# EAGLE board experimenter (EAGLE 9.6.2), part 1 of 3
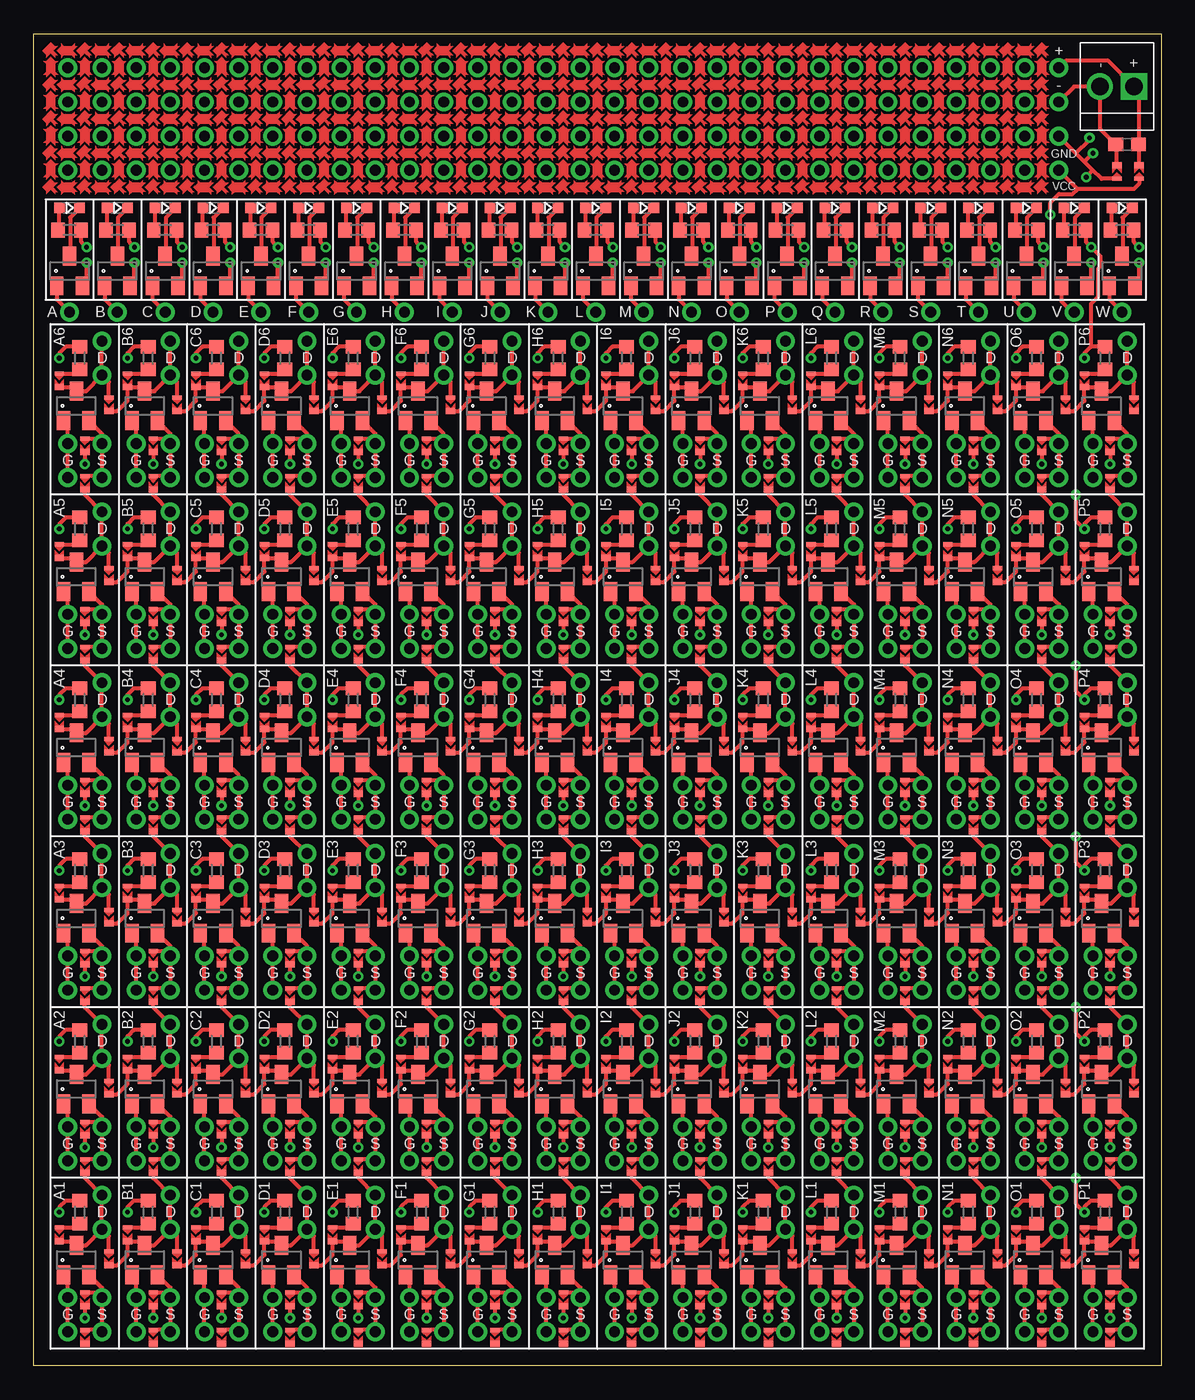
[diagram p3: board, top side]
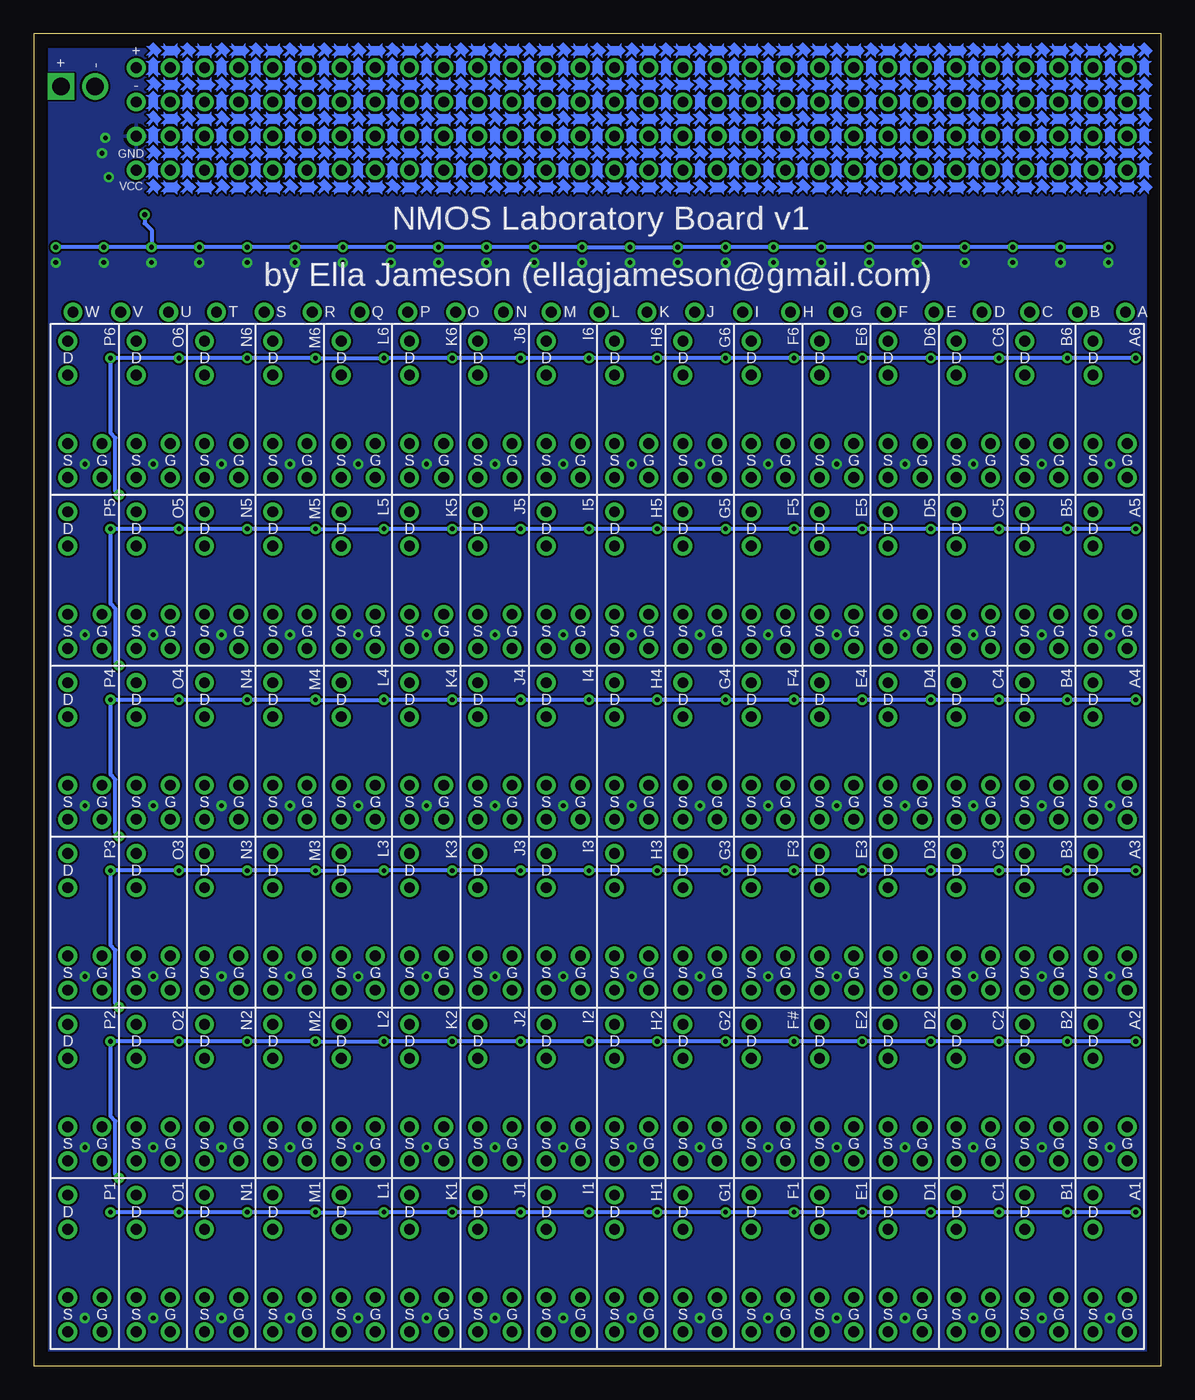
[diagram p4: board, bottom side, seen from below]

Size 83.82 x 99.06 mm. Coordinates in mm from the lower left corner, seen from the top.
Outline: 0,0 0,99.06 83.82,99.06 83.82,0 0,0
Copper layers (1*16): Top 0.035mm / dielectric 1.5mm / Bottom 0.035mm
Design rules "default": minimum track width 6mil, minimum drill 0.35mm, track to track 6mil, track to pad 6mil, pad to pad 6mil, via to via 6mil, smd to smd 6mil, copper to edge 40mil, drill to drill 6mil, minimum pad ring 10mil, minimum via ring 8mil, stop-mask expansion 4mil, vias tented up to drill 0mil, thermal gap 10mil

## Footprints (pad centres in the part's own frame; a part is rotated, then mirrored left to right if it is on the bottom)
C0603 = smd 1.1 x 1: 1 -0.85,0; 2 0.85,0
CHIP-LED0603 = smd 0.8 x 0.8: A 0,-0.75; C 0,0.75
PROTOPAD-THT-PAD = drill 0.8 pad 1.4: P1 0,0
OSTVN02A150 = drill 1.3 square: P$1 -1.27,0 | drill 1.3: P$2 1.27,0
SJ_2S-NO-THIN = smd 0.45 x 0.7: 1 -0.508,0 | smd 0.3 x 0.7: 2 0.508,0
SOT23 = smd 1 x 1.4: 1 -0.95,-1.1; 2 0.95,-1.1; 3 0,1.1
R0603 = smd 1 x 1.1: 1 -0.85,0; 2 0.85,0
PROTOPAD-THT = drill 0.8 pad 1.4: P1 0,0

## Placement (x,y rotation side)
C4  0.1u  [C0603]  81.28,90.81 0 top
D2  [CHIP-LED0603]  2.67,86.11 270 top
D3  [CHIP-LED0603]  16.89,86.11 270 top
D4  [CHIP-LED0603]  6.22,86.11 270 top
D5  [CHIP-LED0603]  24,86.11 270 top
D6  [CHIP-LED0603]  9.78,86.11 270 top
D7  [CHIP-LED0603]  20.45,86.11 270 top
D8  [CHIP-LED0603]  13.34,86.11 270 top
D9  [CHIP-LED0603]  27.56,86.11 270 top
D10  [CHIP-LED0603]  31.11,86.11 270 top
D11  [CHIP-LED0603]  34.67,86.11 270 top
D12  [CHIP-LED0603]  38.23,86.11 270 top
D13  [CHIP-LED0603]  41.78,86.11 270 top
D14  [CHIP-LED0603]  45.34,86.11 270 top
D15  [CHIP-LED0603]  48.9,86.11 270 top
D16  [CHIP-LED0603]  52.45,86.11 270 top
D17  [CHIP-LED0603]  56.01,86.11 270 top
D18  [CHIP-LED0603]  59.56,86.11 270 top
D19  [CHIP-LED0603]  63.12,86.11 270 top
D20  [CHIP-LED0603]  66.67,86.11 270 top
D21  [CHIP-LED0603]  70.23,86.11 270 top
D22  [CHIP-LED0603]  73.79,86.11 270 top
D23  [CHIP-LED0603]  77.34,86.11 270 top
D24  [CHIP-LED0603]  80.9,86.11 270 top
DRAINA2  TPTHT  [PROTOPAD-THT-PAD]  5.08,25.4 0 top
DRAINA3  TPTHT  [PROTOPAD-THT-PAD]  10.16,25.4 0 top
DRAINA4  TPTHT  [PROTOPAD-THT-PAD]  15.24,25.4 0 top
DRAINA5  TPTHT  [PROTOPAD-THT-PAD]  20.32,25.4 0 top
DRAINA21  TPTHT  [PROTOPAD-THT-PAD]  25.4,25.4 0 top
DRAINA22  TPTHT  [PROTOPAD-THT-PAD]  30.48,25.4 0 top
DRAINA23  TPTHT  [PROTOPAD-THT-PAD]  35.56,25.4 0 top
DRAINA24  TPTHT  [PROTOPAD-THT-PAD]  40.64,25.4 0 top
DRAINA25  TPTHT  [PROTOPAD-THT-PAD]  45.72,25.4 0 top
DRAINA26  TPTHT  [PROTOPAD-THT-PAD]  50.8,25.4 0 top
DRAINA27  TPTHT  [PROTOPAD-THT-PAD]  55.88,25.4 0 top
DRAINA28  TPTHT  [PROTOPAD-THT-PAD]  60.96,25.4 0 top
DRAINA29  TPTHT  [PROTOPAD-THT-PAD]  66.04,25.4 0 top
DRAINA30  TPTHT  [PROTOPAD-THT-PAD]  71.12,25.4 0 top
DRAINA31  TPTHT  [PROTOPAD-THT-PAD]  76.2,25.4 0 top
DRAINA32  TPTHT  [PROTOPAD-THT-PAD]  81.28,25.4 0 top
DRAINA33  TPTHT  [PROTOPAD-THT-PAD]  5.08,12.7 0 top
DRAINA34  TPTHT  [PROTOPAD-THT-PAD]  10.16,12.7 0 top
DRAINA35  TPTHT  [PROTOPAD-THT-PAD]  15.24,12.7 0 top
DRAINA36  TPTHT  [PROTOPAD-THT-PAD]  20.32,12.7 0 top
DRAINA37  TPTHT  [PROTOPAD-THT-PAD]  25.4,12.7 0 top
DRAINA38  TPTHT  [PROTOPAD-THT-PAD]  30.48,12.7 0 top
DRAINA39  TPTHT  [PROTOPAD-THT-PAD]  35.56,12.7 0 top
DRAINA40  TPTHT  [PROTOPAD-THT-PAD]  40.64,12.7 0 top
DRAINA41  TPTHT  [PROTOPAD-THT-PAD]  45.72,12.7 0 top
DRAINA42  TPTHT  [PROTOPAD-THT-PAD]  50.8,12.7 0 top
DRAINA43  TPTHT  [PROTOPAD-THT-PAD]  55.88,12.7 0 top
DRAINA44  TPTHT  [PROTOPAD-THT-PAD]  60.96,12.7 0 top
DRAINA45  TPTHT  [PROTOPAD-THT-PAD]  66.04,12.7 0 top
DRAINA46  TPTHT  [PROTOPAD-THT-PAD]  71.12,12.7 0 top
DRAINA47  TPTHT  [PROTOPAD-THT-PAD]  76.2,12.7 0 top
DRAINA48  TPTHT  [PROTOPAD-THT-PAD]  81.28,12.7 0 top
DRAINA49  TPTHT  [PROTOPAD-THT-PAD]  5.08,38.1 0 top
DRAINA50  TPTHT  [PROTOPAD-THT-PAD]  10.16,38.1 0 top
DRAINA51  TPTHT  [PROTOPAD-THT-PAD]  15.24,38.1 0 top
DRAINA52  TPTHT  [PROTOPAD-THT-PAD]  20.32,38.1 0 top
DRAINA53  TPTHT  [PROTOPAD-THT-PAD]  25.4,38.1 0 top
DRAINA54  TPTHT  [PROTOPAD-THT-PAD]  30.48,38.1 0 top
DRAINA55  TPTHT  [PROTOPAD-THT-PAD]  35.56,38.1 0 top
DRAINA56  TPTHT  [PROTOPAD-THT-PAD]  40.64,38.1 0 top
DRAINA57  TPTHT  [PROTOPAD-THT-PAD]  45.72,38.1 0 top
DRAINA58  TPTHT  [PROTOPAD-THT-PAD]  50.8,38.1 0 top
DRAINA59  TPTHT  [PROTOPAD-THT-PAD]  55.88,38.1 0 top
DRAINA60  TPTHT  [PROTOPAD-THT-PAD]  60.96,38.1 0 top
DRAINA61  TPTHT  [PROTOPAD-THT-PAD]  66.04,38.1 0 top
DRAINA62  TPTHT  [PROTOPAD-THT-PAD]  71.12,38.1 0 top
DRAINA63  TPTHT  [PROTOPAD-THT-PAD]  76.2,38.1 0 top
DRAINA64  TPTHT  [PROTOPAD-THT-PAD]  81.28,38.1 0 top
DRAINA65  TPTHT  [PROTOPAD-THT-PAD]  5.08,50.8 0 top
DRAINA66  TPTHT  [PROTOPAD-THT-PAD]  10.16,50.8 0 top
DRAINA67  TPTHT  [PROTOPAD-THT-PAD]  15.24,50.8 0 top
DRAINA68  TPTHT  [PROTOPAD-THT-PAD]  20.32,50.8 0 top
DRAINA69  TPTHT  [PROTOPAD-THT-PAD]  25.4,50.8 0 top
DRAINA70  TPTHT  [PROTOPAD-THT-PAD]  30.48,50.8 0 top
DRAINA71  TPTHT  [PROTOPAD-THT-PAD]  35.56,50.8 0 top
DRAINA72  TPTHT  [PROTOPAD-THT-PAD]  40.64,50.8 0 top
DRAINA73  TPTHT  [PROTOPAD-THT-PAD]  45.72,50.8 0 top
DRAINA74  TPTHT  [PROTOPAD-THT-PAD]  50.8,50.8 0 top
DRAINA75  TPTHT  [PROTOPAD-THT-PAD]  55.88,50.8 0 top
DRAINA76  TPTHT  [PROTOPAD-THT-PAD]  60.96,50.8 0 top
DRAINA77  TPTHT  [PROTOPAD-THT-PAD]  66.04,50.8 0 top
DRAINA78  TPTHT  [PROTOPAD-THT-PAD]  71.12,50.8 0 top
DRAINA79  TPTHT  [PROTOPAD-THT-PAD]  76.2,50.8 0 top
DRAINA80  TPTHT  [PROTOPAD-THT-PAD]  81.28,50.8 0 top
DRAINA81  TPTHT  [PROTOPAD-THT-PAD]  5.08,63.5 0 top
DRAINA82  TPTHT  [PROTOPAD-THT-PAD]  10.16,63.5 0 top
DRAINA83  TPTHT  [PROTOPAD-THT-PAD]  15.24,63.5 0 top
DRAINA84  TPTHT  [PROTOPAD-THT-PAD]  20.32,63.5 0 top
DRAINA85  TPTHT  [PROTOPAD-THT-PAD]  25.4,63.5 0 top
DRAINA86  TPTHT  [PROTOPAD-THT-PAD]  30.48,63.5 0 top
DRAINA87  TPTHT  [PROTOPAD-THT-PAD]  35.56,63.5 0 top
DRAINA88  TPTHT  [PROTOPAD-THT-PAD]  40.64,63.5 0 top
DRAINA89  TPTHT  [PROTOPAD-THT-PAD]  45.72,63.5 0 top
DRAINA90  TPTHT  [PROTOPAD-THT-PAD]  50.8,63.5 0 top
DRAINA91  TPTHT  [PROTOPAD-THT-PAD]  55.88,63.5 0 top
DRAINA92  TPTHT  [PROTOPAD-THT-PAD]  60.96,63.5 0 top
DRAINA93  TPTHT  [PROTOPAD-THT-PAD]  66.04,63.5 0 top
DRAINA94  TPTHT  [PROTOPAD-THT-PAD]  71.12,63.5 0 top
DRAINA95  TPTHT  [PROTOPAD-THT-PAD]  76.2,63.5 0 top
DRAINA96  TPTHT  [PROTOPAD-THT-PAD]  81.28,63.5 0 top
DRAINA97  TPTHT  [PROTOPAD-THT-PAD]  5.08,76.2 0 top
DRAINA98  TPTHT  [PROTOPAD-THT-PAD]  10.16,76.2 0 top
DRAINA99  TPTHT  [PROTOPAD-THT-PAD]  15.24,76.2 0 top
DRAINA100  TPTHT  [PROTOPAD-THT-PAD]  20.32,76.2 0 top
DRAINA101  TPTHT  [PROTOPAD-THT-PAD]  25.4,76.2 0 top
DRAINA102  TPTHT  [PROTOPAD-THT-PAD]  30.48,76.2 0 top
DRAINA103  TPTHT  [PROTOPAD-THT-PAD]  35.56,76.2 0 top
DRAINA104  TPTHT  [PROTOPAD-THT-PAD]  40.64,76.2 0 top
DRAINA105  TPTHT  [PROTOPAD-THT-PAD]  45.72,76.2 0 top
DRAINA106  TPTHT  [PROTOPAD-THT-PAD]  50.8,76.2 0 top
DRAINA107  TPTHT  [PROTOPAD-THT-PAD]  55.88,76.2 0 top
DRAINA108  TPTHT  [PROTOPAD-THT-PAD]  60.96,76.2 0 top
DRAINA109  TPTHT  [PROTOPAD-THT-PAD]  66.04,76.2 0 top
DRAINA110  TPTHT  [PROTOPAD-THT-PAD]  71.12,76.2 0 top
DRAINA111  TPTHT  [PROTOPAD-THT-PAD]  76.2,76.2 0 top
DRAINA112  TPTHT  [PROTOPAD-THT-PAD]  81.28,76.2 0 top
DRAINB2  TPTHT  [PROTOPAD-THT-PAD]  5.08,22.86 0 top
DRAINB3  TPTHT  [PROTOPAD-THT-PAD]  10.16,22.86 0 top
DRAINB4  TPTHT  [PROTOPAD-THT-PAD]  15.24,22.86 0 top
DRAINB5  TPTHT  [PROTOPAD-THT-PAD]  20.32,22.86 0 top
DRAINB21  TPTHT  [PROTOPAD-THT-PAD]  25.4,22.86 0 top
DRAINB22  TPTHT  [PROTOPAD-THT-PAD]  30.48,22.86 0 top
DRAINB23  TPTHT  [PROTOPAD-THT-PAD]  35.56,22.86 0 top
DRAINB24  TPTHT  [PROTOPAD-THT-PAD]  40.64,22.86 0 top
DRAINB25  TPTHT  [PROTOPAD-THT-PAD]  45.72,22.86 0 top
DRAINB26  TPTHT  [PROTOPAD-THT-PAD]  50.8,22.86 0 top
DRAINB27  TPTHT  [PROTOPAD-THT-PAD]  55.88,22.86 0 top
DRAINB28  TPTHT  [PROTOPAD-THT-PAD]  60.96,22.86 0 top
DRAINB29  TPTHT  [PROTOPAD-THT-PAD]  66.04,22.86 0 top
DRAINB30  TPTHT  [PROTOPAD-THT-PAD]  71.12,22.86 0 top
DRAINB31  TPTHT  [PROTOPAD-THT-PAD]  76.2,22.86 0 top
DRAINB32  TPTHT  [PROTOPAD-THT-PAD]  81.28,22.86 0 top
DRAINB33  TPTHT  [PROTOPAD-THT-PAD]  5.08,10.16 0 top
DRAINB34  TPTHT  [PROTOPAD-THT-PAD]  10.16,10.16 0 top
DRAINB35  TPTHT  [PROTOPAD-THT-PAD]  15.24,10.16 0 top
DRAINB36  TPTHT  [PROTOPAD-THT-PAD]  20.32,10.16 0 top
DRAINB37  TPTHT  [PROTOPAD-THT-PAD]  25.4,10.16 0 top
DRAINB38  TPTHT  [PROTOPAD-THT-PAD]  30.48,10.16 0 top
DRAINB39  TPTHT  [PROTOPAD-THT-PAD]  35.56,10.16 0 top
DRAINB40  TPTHT  [PROTOPAD-THT-PAD]  40.64,10.16 0 top
DRAINB41  TPTHT  [PROTOPAD-THT-PAD]  45.72,10.16 0 top
DRAINB42  TPTHT  [PROTOPAD-THT-PAD]  50.8,10.16 0 top
DRAINB43  TPTHT  [PROTOPAD-THT-PAD]  55.88,10.16 0 top
DRAINB44  TPTHT  [PROTOPAD-THT-PAD]  60.96,10.16 0 top
DRAINB45  TPTHT  [PROTOPAD-THT-PAD]  66.04,10.16 0 top
DRAINB46  TPTHT  [PROTOPAD-THT-PAD]  71.12,10.16 0 top
DRAINB47  TPTHT  [PROTOPAD-THT-PAD]  76.2,10.16 0 top
DRAINB48  TPTHT  [PROTOPAD-THT-PAD]  81.28,10.16 0 top
DRAINB49  TPTHT  [PROTOPAD-THT-PAD]  5.08,35.56 0 top
DRAINB50  TPTHT  [PROTOPAD-THT-PAD]  10.16,35.56 0 top
DRAINB51  TPTHT  [PROTOPAD-THT-PAD]  15.24,35.56 0 top
DRAINB52  TPTHT  [PROTOPAD-THT-PAD]  20.32,35.56 0 top
DRAINB53  TPTHT  [PROTOPAD-THT-PAD]  25.4,35.56 0 top
DRAINB54  TPTHT  [PROTOPAD-THT-PAD]  30.48,35.56 0 top
DRAINB55  TPTHT  [PROTOPAD-THT-PAD]  35.56,35.56 0 top
DRAINB56  TPTHT  [PROTOPAD-THT-PAD]  40.64,35.56 0 top
DRAINB57  TPTHT  [PROTOPAD-THT-PAD]  45.72,35.56 0 top
DRAINB58  TPTHT  [PROTOPAD-THT-PAD]  50.8,35.56 0 top
DRAINB59  TPTHT  [PROTOPAD-THT-PAD]  55.88,35.56 0 top
DRAINB60  TPTHT  [PROTOPAD-THT-PAD]  60.96,35.56 0 top
DRAINB61  TPTHT  [PROTOPAD-THT-PAD]  66.04,35.56 0 top
DRAINB62  TPTHT  [PROTOPAD-THT-PAD]  71.12,35.56 0 top
DRAINB63  TPTHT  [PROTOPAD-THT-PAD]  76.2,35.56 0 top
DRAINB64  TPTHT  [PROTOPAD-THT-PAD]  81.28,35.56 0 top
DRAINB65  TPTHT  [PROTOPAD-THT-PAD]  5.08,48.26 0 top
DRAINB66  TPTHT  [PROTOPAD-THT-PAD]  10.16,48.26 0 top
DRAINB67  TPTHT  [PROTOPAD-THT-PAD]  15.24,48.26 0 top
DRAINB68  TPTHT  [PROTOPAD-THT-PAD]  20.32,48.26 0 top
DRAINB69  TPTHT  [PROTOPAD-THT-PAD]  25.4,48.26 0 top
DRAINB70  TPTHT  [PROTOPAD-THT-PAD]  30.48,48.26 0 top
DRAINB71  TPTHT  [PROTOPAD-THT-PAD]  35.56,48.26 0 top
DRAINB72  TPTHT  [PROTOPAD-THT-PAD]  40.64,48.26 0 top
DRAINB73  TPTHT  [PROTOPAD-THT-PAD]  45.72,48.26 0 top
DRAINB74  TPTHT  [PROTOPAD-THT-PAD]  50.8,48.26 0 top
DRAINB75  TPTHT  [PROTOPAD-THT-PAD]  55.88,48.26 0 top
DRAINB76  TPTHT  [PROTOPAD-THT-PAD]  60.96,48.26 0 top
DRAINB77  TPTHT  [PROTOPAD-THT-PAD]  66.04,48.26 0 top
DRAINB78  TPTHT  [PROTOPAD-THT-PAD]  71.12,48.26 0 top
DRAINB79  TPTHT  [PROTOPAD-THT-PAD]  76.2,48.26 0 top
DRAINB80  TPTHT  [PROTOPAD-THT-PAD]  81.28,48.26 0 top
DRAINB81  TPTHT  [PROTOPAD-THT-PAD]  5.08,60.96 0 top
DRAINB82  TPTHT  [PROTOPAD-THT-PAD]  10.16,60.96 0 top
DRAINB83  TPTHT  [PROTOPAD-THT-PAD]  15.24,60.96 0 top
DRAINB84  TPTHT  [PROTOPAD-THT-PAD]  20.32,60.96 0 top
DRAINB85  TPTHT  [PROTOPAD-THT-PAD]  25.4,60.96 0 top
DRAINB86  TPTHT  [PROTOPAD-THT-PAD]  30.48,60.96 0 top
DRAINB87  TPTHT  [PROTOPAD-THT-PAD]  35.56,60.96 0 top
DRAINB88  TPTHT  [PROTOPAD-THT-PAD]  40.64,60.96 0 top
DRAINB89  TPTHT  [PROTOPAD-THT-PAD]  45.72,60.96 0 top
DRAINB90  TPTHT  [PROTOPAD-THT-PAD]  50.8,60.96 0 top
DRAINB91  TPTHT  [PROTOPAD-THT-PAD]  55.88,60.96 0 top
DRAINB92  TPTHT  [PROTOPAD-THT-PAD]  60.96,60.96 0 top
DRAINB93  TPTHT  [PROTOPAD-THT-PAD]  66.04,60.96 0 top
DRAINB94  TPTHT  [PROTOPAD-THT-PAD]  71.12,60.96 0 top
DRAINB95  TPTHT  [PROTOPAD-THT-PAD]  76.2,60.96 0 top
DRAINB96  TPTHT  [PROTOPAD-THT-PAD]  81.28,60.96 0 top
DRAINB97  TPTHT  [PROTOPAD-THT-PAD]  5.08,73.66 0 top
DRAINB98  TPTHT  [PROTOPAD-THT-PAD]  10.16,73.66 0 top
DRAINB99  TPTHT  [PROTOPAD-THT-PAD]  15.24,73.66 0 top
DRAINB100  TPTHT  [PROTOPAD-THT-PAD]  20.32,73.66 0 top
DRAINB101  TPTHT  [PROTOPAD-THT-PAD]  25.4,73.66 0 top
DRAINB102  TPTHT  [PROTOPAD-THT-PAD]  30.48,73.66 0 top
DRAINB103  TPTHT  [PROTOPAD-THT-PAD]  35.56,73.66 0 top
DRAINB104  TPTHT  [PROTOPAD-THT-PAD]  40.64,73.66 0 top
DRAINB105  TPTHT  [PROTOPAD-THT-PAD]  45.72,73.66 0 top
DRAINB106  TPTHT  [PROTOPAD-THT-PAD]  50.8,73.66 0 top
DRAINB107  TPTHT  [PROTOPAD-THT-PAD]  55.88,73.66 0 top
DRAINB108  TPTHT  [PROTOPAD-THT-PAD]  60.96,73.66 0 top
DRAINB109  TPTHT  [PROTOPAD-THT-PAD]  66.04,73.66 0 top
DRAINB110  TPTHT  [PROTOPAD-THT-PAD]  71.12,73.66 0 top
DRAINB111  TPTHT  [PROTOPAD-THT-PAD]  76.2,73.66 0 top
DRAINB112  TPTHT  [PROTOPAD-THT-PAD]  81.28,73.66 0 top
GATEA2  TPTHT  [PROTOPAD-THT-PAD]  2.54,17.78 0 top
GATEA3  TPTHT  [PROTOPAD-THT-PAD]  7.62,17.78 0 top
GATEA4  TPTHT  [PROTOPAD-THT-PAD]  12.7,17.78 0 top
GATEA5  TPTHT  [PROTOPAD-THT-PAD]  17.78,17.78 0 top
GATEA21  TPTHT  [PROTOPAD-THT-PAD]  22.86,17.78 0 top
GATEA22  TPTHT  [PROTOPAD-THT-PAD]  27.94,17.78 0 top
GATEA23  TPTHT  [PROTOPAD-THT-PAD]  33.02,17.78 0 top
GATEA24  TPTHT  [PROTOPAD-THT-PAD]  38.1,17.78 0 top
GATEA25  TPTHT  [PROTOPAD-THT-PAD]  43.18,17.78 0 top
GATEA26  TPTHT  [PROTOPAD-THT-PAD]  48.26,17.78 0 top
GATEA27  TPTHT  [PROTOPAD-THT-PAD]  53.34,17.78 0 top
GATEA28  TPTHT  [PROTOPAD-THT-PAD]  58.42,17.78 0 top
GATEA29  TPTHT  [PROTOPAD-THT-PAD]  63.5,17.78 0 top
GATEA30  TPTHT  [PROTOPAD-THT-PAD]  68.58,17.78 0 top
GATEA31  TPTHT  [PROTOPAD-THT-PAD]  73.66,17.78 0 top
GATEA32  TPTHT  [PROTOPAD-THT-PAD]  78.74,17.78 0 top
GATEA33  TPTHT  [PROTOPAD-THT-PAD]  2.54,5.08 0 top
GATEA34  TPTHT  [PROTOPAD-THT-PAD]  7.62,5.08 0 top
GATEA35  TPTHT  [PROTOPAD-THT-PAD]  12.7,5.08 0 top
GATEA36  TPTHT  [PROTOPAD-THT-PAD]  17.78,5.08 0 top
GATEA37  TPTHT  [PROTOPAD-THT-PAD]  22.86,5.08 0 top
GATEA38  TPTHT  [PROTOPAD-THT-PAD]  27.94,5.08 0 top
GATEA39  TPTHT  [PROTOPAD-THT-PAD]  33.02,5.08 0 top
GATEA40  TPTHT  [PROTOPAD-THT-PAD]  38.1,5.08 0 top
GATEA41  TPTHT  [PROTOPAD-THT-PAD]  43.18,5.08 0 top
GATEA42  TPTHT  [PROTOPAD-THT-PAD]  48.26,5.08 0 top
GATEA43  TPTHT  [PROTOPAD-THT-PAD]  53.34,5.08 0 top
GATEA44  TPTHT  [PROTOPAD-THT-PAD]  58.42,5.08 0 top
GATEA45  TPTHT  [PROTOPAD-THT-PAD]  63.5,5.08 0 top
GATEA46  TPTHT  [PROTOPAD-THT-PAD]  68.58,5.08 0 top
GATEA47  TPTHT  [PROTOPAD-THT-PAD]  73.66,5.08 0 top
GATEA48  TPTHT  [PROTOPAD-THT-PAD]  78.74,5.08 0 top
GATEA49  TPTHT  [PROTOPAD-THT-PAD]  2.54,30.48 0 top
GATEA50  TPTHT  [PROTOPAD-THT-PAD]  7.62,30.48 0 top
GATEA51  TPTHT  [PROTOPAD-THT-PAD]  12.7,30.48 0 top
GATEA52  TPTHT  [PROTOPAD-THT-PAD]  17.78,30.48 0 top
GATEA53  TPTHT  [PROTOPAD-THT-PAD]  22.86,30.48 0 top
GATEA54  TPTHT  [PROTOPAD-THT-PAD]  27.94,30.48 0 top
GATEA55  TPTHT  [PROTOPAD-THT-PAD]  33.02,30.48 0 top
GATEA56  TPTHT  [PROTOPAD-THT-PAD]  38.1,30.48 0 top
GATEA57  TPTHT  [PROTOPAD-THT-PAD]  43.18,30.48 0 top
GATEA58  TPTHT  [PROTOPAD-THT-PAD]  48.26,30.48 0 top
GATEA59  TPTHT  [PROTOPAD-THT-PAD]  53.34,30.48 0 top
GATEA60  TPTHT  [PROTOPAD-THT-PAD]  58.42,30.48 0 top
GATEA61  TPTHT  [PROTOPAD-THT-PAD]  63.5,30.48 0 top
GATEA62  TPTHT  [PROTOPAD-THT-PAD]  68.58,30.48 0 top
GATEA63  TPTHT  [PROTOPAD-THT-PAD]  73.66,30.48 0 top
GATEA64  TPTHT  [PROTOPAD-THT-PAD]  78.74,30.48 0 top
GATEA65  TPTHT  [PROTOPAD-THT-PAD]  2.54,43.18 0 top
GATEA66  TPTHT  [PROTOPAD-THT-PAD]  7.62,43.18 0 top
GATEA67  TPTHT  [PROTOPAD-THT-PAD]  12.7,43.18 0 top
GATEA68  TPTHT  [PROTOPAD-THT-PAD]  17.78,43.18 0 top
GATEA69  TPTHT  [PROTOPAD-THT-PAD]  22.86,43.18 0 top
GATEA70  TPTHT  [PROTOPAD-THT-PAD]  27.94,43.18 0 top
GATEA71  TPTHT  [PROTOPAD-THT-PAD]  33.02,43.18 0 top
GATEA72  TPTHT  [PROTOPAD-THT-PAD]  38.1,43.18 0 top
GATEA73  TPTHT  [PROTOPAD-THT-PAD]  43.18,43.18 0 top
GATEA74  TPTHT  [PROTOPAD-THT-PAD]  48.26,43.18 0 top
GATEA75  TPTHT  [PROTOPAD-THT-PAD]  53.34,43.18 0 top
GATEA76  TPTHT  [PROTOPAD-THT-PAD]  58.42,43.18 0 top
GATEA77  TPTHT  [PROTOPAD-THT-PAD]  63.5,43.18 0 top
GATEA78  TPTHT  [PROTOPAD-THT-PAD]  68.58,43.18 0 top
GATEA79  TPTHT  [PROTOPAD-THT-PAD]  73.66,43.18 0 top
GATEA80  TPTHT  [PROTOPAD-THT-PAD]  78.74,43.18 0 top
GATEA81  TPTHT  [PROTOPAD-THT-PAD]  2.54,55.88 0 top
GATEA82  TPTHT  [PROTOPAD-THT-PAD]  7.62,55.88 0 top
GATEA83  TPTHT  [PROTOPAD-THT-PAD]  12.7,55.88 0 top
GATEA84  TPTHT  [PROTOPAD-THT-PAD]  17.78,55.88 0 top
GATEA85  TPTHT  [PROTOPAD-THT-PAD]  22.86,55.88 0 top
GATEA86  TPTHT  [PROTOPAD-THT-PAD]  27.94,55.88 0 top
GATEA87  TPTHT  [PROTOPAD-THT-PAD]  33.02,55.88 0 top
GATEA88  TPTHT  [PROTOPAD-THT-PAD]  38.1,55.88 0 top
GATEA89  TPTHT  [PROTOPAD-THT-PAD]  43.18,55.88 0 top
GATEA90  TPTHT  [PROTOPAD-THT-PAD]  48.26,55.88 0 top
GATEA91  TPTHT  [PROTOPAD-THT-PAD]  53.34,55.88 0 top
GATEA92  TPTHT  [PROTOPAD-THT-PAD]  58.42,55.88 0 top
GATEA93  TPTHT  [PROTOPAD-THT-PAD]  63.5,55.88 0 top
GATEA94  TPTHT  [PROTOPAD-THT-PAD]  68.58,55.88 0 top
GATEA95  TPTHT  [PROTOPAD-THT-PAD]  73.66,55.88 0 top
GATEA96  TPTHT  [PROTOPAD-THT-PAD]  78.74,55.88 0 top
GATEA97  TPTHT  [PROTOPAD-THT-PAD]  2.54,68.58 0 top
GATEA98  TPTHT  [PROTOPAD-THT-PAD]  7.62,68.58 0 top
GATEA99  TPTHT  [PROTOPAD-THT-PAD]  12.7,68.58 0 top
GATEA100  TPTHT  [PROTOPAD-THT-PAD]  17.78,68.58 0 top
GATEA101  TPTHT  [PROTOPAD-THT-PAD]  22.86,68.58 0 top
GATEA102  TPTHT  [PROTOPAD-THT-PAD]  27.94,68.58 0 top
GATEA103  TPTHT  [PROTOPAD-THT-PAD]  33.02,68.58 0 top
GATEA104  TPTHT  [PROTOPAD-THT-PAD]  38.1,68.58 0 top
GATEA105  TPTHT  [PROTOPAD-THT-PAD]  43.18,68.58 0 top
GATEA106  TPTHT  [PROTOPAD-THT-PAD]  48.26,68.58 0 top
GATEA107  TPTHT  [PROTOPAD-THT-PAD]  53.34,68.58 0 top
GATEA108  TPTHT  [PROTOPAD-THT-PAD]  58.42,68.58 0 top
GATEA109  TPTHT  [PROTOPAD-THT-PAD]  63.5,68.58 0 top
GATEA110  TPTHT  [PROTOPAD-THT-PAD]  68.58,68.58 0 top
GATEA111  TPTHT  [PROTOPAD-THT-PAD]  73.66,68.58 0 top
GATEA112  TPTHT  [PROTOPAD-THT-PAD]  78.74,68.58 0 top
GATEB2  TPTHT  [PROTOPAD-THT-PAD]  2.54,15.24 0 top
GATEB3  TPTHT  [PROTOPAD-THT-PAD]  7.62,15.24 0 top
GATEB4  TPTHT  [PROTOPAD-THT-PAD]  12.7,15.24 0 top
GATEB5  TPTHT  [PROTOPAD-THT-PAD]  17.78,15.24 0 top
GATEB21  TPTHT  [PROTOPAD-THT-PAD]  22.86,15.24 0 top
GATEB22  TPTHT  [PROTOPAD-THT-PAD]  27.94,15.24 0 top
GATEB23  TPTHT  [PROTOPAD-THT-PAD]  33.02,15.24 0 top
GATEB24  TPTHT  [PROTOPAD-THT-PAD]  38.1,15.24 0 top
GATEB25  TPTHT  [PROTOPAD-THT-PAD]  43.18,15.24 0 top
GATEB26  TPTHT  [PROTOPAD-THT-PAD]  48.26,15.24 0 top
GATEB27  TPTHT  [PROTOPAD-THT-PAD]  53.34,15.24 0 top
GATEB28  TPTHT  [PROTOPAD-THT-PAD]  58.42,15.24 0 top
GATEB29  TPTHT  [PROTOPAD-THT-PAD]  63.5,15.24 0 top
GATEB30  TPTHT  [PROTOPAD-THT-PAD]  68.58,15.24 0 top
GATEB31  TPTHT  [PROTOPAD-THT-PAD]  73.66,15.24 0 top
GATEB32  TPTHT  [PROTOPAD-THT-PAD]  78.74,15.24 0 top
GATEB33  TPTHT  [PROTOPAD-THT-PAD]  2.54,2.54 0 top
GATEB34  TPTHT  [PROTOPAD-THT-PAD]  7.62,2.54 0 top
GATEB35  TPTHT  [PROTOPAD-THT-PAD]  12.7,2.54 0 top
GATEB36  TPTHT  [PROTOPAD-THT-PAD]  17.78,2.54 0 top
GATEB37  TPTHT  [PROTOPAD-THT-PAD]  22.86,2.54 0 top
GATEB38  TPTHT  [PROTOPAD-THT-PAD]  27.94,2.54 0 top
GATEB39  TPTHT  [PROTOPAD-THT-PAD]  33.02,2.54 0 top
GATEB40  TPTHT  [PROTOPAD-THT-PAD]  38.1,2.54 0 top
GATEB41  TPTHT  [PROTOPAD-THT-PAD]  43.18,2.54 0 top
GATEB42  TPTHT  [PROTOPAD-THT-PAD]  48.26,2.54 0 top
GATEB43  TPTHT  [PROTOPAD-THT-PAD]  53.34,2.54 0 top
GATEB44  TPTHT  [PROTOPAD-THT-PAD]  58.42,2.54 0 top
GATEB45  TPTHT  [PROTOPAD-THT-PAD]  63.5,2.54 0 top
GATEB46  TPTHT  [PROTOPAD-THT-PAD]  68.58,2.54 0 top
GATEB47  TPTHT  [PROTOPAD-THT-PAD]  73.66,2.54 0 top
GATEB48  TPTHT  [PROTOPAD-THT-PAD]  78.74,2.54 0 top
GATEB49  TPTHT  [PROTOPAD-THT-PAD]  2.54,27.94 0 top
GATEB50  TPTHT  [PROTOPAD-THT-PAD]  7.62,27.94 0 top
GATEB51  TPTHT  [PROTOPAD-THT-PAD]  12.7,27.94 0 top
GATEB52  TPTHT  [PROTOPAD-THT-PAD]  17.78,27.94 0 top
GATEB53  TPTHT  [PROTOPAD-THT-PAD]  22.86,27.94 0 top
GATEB54  TPTHT  [PROTOPAD-THT-PAD]  27.94,27.94 0 top
GATEB55  TPTHT  [PROTOPAD-THT-PAD]  33.02,27.94 0 top
GATEB56  TPTHT  [PROTOPAD-THT-PAD]  38.1,27.94 0 top
GATEB57  TPTHT  [PROTOPAD-THT-PAD]  43.18,27.94 0 top
GATEB58  TPTHT  [PROTOPAD-THT-PAD]  48.26,27.94 0 top
GATEB59  TPTHT  [PROTOPAD-THT-PAD]  53.34,27.94 0 top
GATEB60  TPTHT  [PROTOPAD-THT-PAD]  58.42,27.94 0 top
GATEB61  TPTHT  [PROTOPAD-THT-PAD]  63.5,27.94 0 top
GATEB62  TPTHT  [PROTOPAD-THT-PAD]  68.58,27.94 0 top
GATEB63  TPTHT  [PROTOPAD-THT-PAD]  73.66,27.94 0 top
GATEB64  TPTHT  [PROTOPAD-THT-PAD]  78.74,27.94 0 top
GATEB65  TPTHT  [PROTOPAD-THT-PAD]  2.54,40.64 0 top
GATEB66  TPTHT  [PROTOPAD-THT-PAD]  7.62,40.64 0 top
GATEB67  TPTHT  [PROTOPAD-THT-PAD]  12.7,40.64 0 top
GATEB68  TPTHT  [PROTOPAD-THT-PAD]  17.78,40.64 0 top
GATEB69  TPTHT  [PROTOPAD-THT-PAD]  22.86,40.64 0 top
GATEB70  TPTHT  [PROTOPAD-THT-PAD]  27.94,40.64 0 top
GATEB71  TPTHT  [PROTOPAD-THT-PAD]  33.02,40.64 0 top
GATEB72  TPTHT  [PROTOPAD-THT-PAD]  38.1,40.64 0 top
GATEB73  TPTHT  [PROTOPAD-THT-PAD]  43.18,40.64 0 top
GATEB74  TPTHT  [PROTOPAD-THT-PAD]  48.26,40.64 0 top
GATEB75  TPTHT  [PROTOPAD-THT-PAD]  53.34,40.64 0 top
GATEB76  TPTHT  [PROTOPAD-THT-PAD]  58.42,40.64 0 top
GATEB77  TPTHT  [PROTOPAD-THT-PAD]  63.5,40.64 0 top
GATEB78  TPTHT  [PROTOPAD-THT-PAD]  68.58,40.64 0 top
GATEB79  TPTHT  [PROTOPAD-THT-PAD]  73.66,40.64 0 top
GATEB80  TPTHT  [PROTOPAD-THT-PAD]  78.74,40.64 0 top
GATEB81  TPTHT  [PROTOPAD-THT-PAD]  2.54,53.34 0 top
GATEB82  TPTHT  [PROTOPAD-THT-PAD]  7.62,53.34 0 top
GATEB83  TPTHT  [PROTOPAD-THT-PAD]  12.7,53.34 0 top
GATEB84  TPTHT  [PROTOPAD-THT-PAD]  17.78,53.34 0 top
GATEB85  TPTHT  [PROTOPAD-THT-PAD]  22.86,53.34 0 top
GATEB86  TPTHT  [PROTOPAD-THT-PAD]  27.94,53.34 0 top
GATEB87  TPTHT  [PROTOPAD-THT-PAD]  33.02,53.34 0 top
GATEB88  TPTHT  [PROTOPAD-THT-PAD]  38.1,53.34 0 top
GATEB89  TPTHT  [PROTOPAD-THT-PAD]  43.18,53.34 0 top
GATEB90  TPTHT  [PROTOPAD-THT-PAD]  48.26,53.34 0 top
GATEB91  TPTHT  [PROTOPAD-THT-PAD]  53.34,53.34 0 top
GATEB92  TPTHT  [PROTOPAD-THT-PAD]  58.42,53.34 0 top
GATEB93  TPTHT  [PROTOPAD-THT-PAD]  63.5,53.34 0 top
GATEB94  TPTHT  [PROTOPAD-THT-PAD]  68.58,53.34 0 top
GATEB95  TPTHT  [PROTOPAD-THT-PAD]  73.66,53.34 0 top
GATEB96  TPTHT  [PROTOPAD-THT-PAD]  78.74,53.34 0 top
GATEB97  TPTHT  [PROTOPAD-THT-PAD]  2.54,66.04 0 top
GATEB98  TPTHT  [PROTOPAD-THT-PAD]  7.62,66.04 0 top
GATEB99  TPTHT  [PROTOPAD-THT-PAD]  12.7,66.04 0 top
GATEB100  TPTHT  [PROTOPAD-THT-PAD]  17.78,66.04 0 top
GATEB101  TPTHT  [PROTOPAD-THT-PAD]  22.86,66.04 0 top
GATEB102  TPTHT  [PROTOPAD-THT-PAD]  27.94,66.04 0 top
GATEB103  TPTHT  [PROTOPAD-THT-PAD]  33.02,66.04 0 top
GATEB104  TPTHT  [PROTOPAD-THT-PAD]  38.1,66.04 0 top
GATEB105  TPTHT  [PROTOPAD-THT-PAD]  43.18,66.04 0 top
GATEB106  TPTHT  [PROTOPAD-THT-PAD]  48.26,66.04 0 top
GATEB107  TPTHT  [PROTOPAD-THT-PAD]  53.34,66.04 0 top
GATEB108  TPTHT  [PROTOPAD-THT-PAD]  58.42,66.04 0 top
GATEB109  TPTHT  [PROTOPAD-THT-PAD]  63.5,66.04 0 top
GATEB110  TPTHT  [PROTOPAD-THT-PAD]  68.58,66.04 0 top
GATEB111  TPTHT  [PROTOPAD-THT-PAD]  73.66,66.04 0 top
GATEB112  TPTHT  [PROTOPAD-THT-PAD]  78.74,66.04 0 top
J1  [OSTVN02A150]  80.52,95.12 180 top
JD2  SJ_NO_THIN  [SJ_2S-NO-THIN]  5.59,20.7 90 top
JD3  SJ_NO_THIN  [SJ_2S-NO-THIN]  10.67,20.7 90 top
JD4  SJ_NO_THIN  [SJ_2S-NO-THIN]  15.75,20.7 90 top
JD5  SJ_NO_THIN  [SJ_2S-NO-THIN]  20.83,20.7 90 top
JD21  SJ_NO_THIN  [SJ_2S-NO-THIN]  25.91,20.7 90 top
JD22  SJ_NO_THIN  [SJ_2S-NO-THIN]  30.99,20.7 90 top
JD23  SJ_NO_THIN  [SJ_2S-NO-THIN]  36.07,20.7 90 top
JD24  SJ_NO_THIN  [SJ_2S-NO-THIN]  41.15,20.7 90 top
JD25  SJ_NO_THIN  [SJ_2S-NO-THIN]  46.23,20.7 90 top
JD26  SJ_NO_THIN  [SJ_2S-NO-THIN]  51.31,20.7 90 top
JD27  SJ_NO_THIN  [SJ_2S-NO-THIN]  56.39,20.7 90 top
JD28  SJ_NO_THIN  [SJ_2S-NO-THIN]  61.47,20.7 90 top
JD29  SJ_NO_THIN  [SJ_2S-NO-THIN]  66.55,20.7 90 top
JD30  SJ_NO_THIN  [SJ_2S-NO-THIN]  71.63,20.7 90 top
JD31  SJ_NO_THIN  [SJ_2S-NO-THIN]  76.71,20.7 90 top
JD32  SJ_NO_THIN  [SJ_2S-NO-THIN]  81.79,20.7 90 top
JD33  SJ_NO_THIN  [SJ_2S-NO-THIN]  5.59,8 90 top
JD34  SJ_NO_THIN  [SJ_2S-NO-THIN]  10.67,8 90 top
JD35  SJ_NO_THIN  [SJ_2S-NO-THIN]  15.75,8 90 top
JD36  SJ_NO_THIN  [SJ_2S-NO-THIN]  20.83,8 90 top
JD37  SJ_NO_THIN  [SJ_2S-NO-THIN]  25.91,8 90 top
JD38  SJ_NO_THIN  [SJ_2S-NO-THIN]  30.99,8 90 top
JD39  SJ_NO_THIN  [SJ_2S-NO-THIN]  36.07,8 90 top
JD40  SJ_NO_THIN  [SJ_2S-NO-THIN]  41.15,8 90 top
JD41  SJ_NO_THIN  [SJ_2S-NO-THIN]  46.23,8 90 top
JD42  SJ_NO_THIN  [SJ_2S-NO-THIN]  51.31,8 90 top
JD43  SJ_NO_THIN  [SJ_2S-NO-THIN]  56.39,8 90 top
JD44  SJ_NO_THIN  [SJ_2S-NO-THIN]  61.47,8 90 top
JD45  SJ_NO_THIN  [SJ_2S-NO-THIN]  66.55,8 90 top
JD46  SJ_NO_THIN  [SJ_2S-NO-THIN]  71.63,8 90 top
JD47  SJ_NO_THIN  [SJ_2S-NO-THIN]  76.71,8 90 top
JD48  SJ_NO_THIN  [SJ_2S-NO-THIN]  81.79,8 90 top
JD49  SJ_NO_THIN  [SJ_2S-NO-THIN]  5.59,33.4 90 top
JD50  SJ_NO_THIN  [SJ_2S-NO-THIN]  10.67,33.4 90 top
JD51  SJ_NO_THIN  [SJ_2S-NO-THIN]  15.75,33.4 90 top
JD52  SJ_NO_THIN  [SJ_2S-NO-THIN]  20.83,33.4 90 top
JD53  SJ_NO_THIN  [SJ_2S-NO-THIN]  25.91,33.4 90 top
JD54  SJ_NO_THIN  [SJ_2S-NO-THIN]  30.99,33.4 90 top
JD55  SJ_NO_THIN  [SJ_2S-NO-THIN]  36.07,33.4 90 top
JD56  SJ_NO_THIN  [SJ_2S-NO-THIN]  41.15,33.4 90 top
JD57  SJ_NO_THIN  [SJ_2S-NO-THIN]  46.23,33.4 90 top
JD58  SJ_NO_THIN  [SJ_2S-NO-THIN]  51.31,33.4 90 top
JD59  SJ_NO_THIN  [SJ_2S-NO-THIN]  56.39,33.4 90 top
JD60  SJ_NO_THIN  [SJ_2S-NO-THIN]  61.47,33.4 90 top
JD61  SJ_NO_THIN  [SJ_2S-NO-THIN]  66.55,33.4 90 top
JD62  SJ_NO_THIN  [SJ_2S-NO-THIN]  71.63,33.4 90 top
JD63  SJ_NO_THIN  [SJ_2S-NO-THIN]  76.71,33.4 90 top
JD64  SJ_NO_THIN  [SJ_2S-NO-THIN]  81.79,33.4 90 top
JD65  SJ_NO_THIN  [SJ_2S-NO-THIN]  5.59,46.1 90 top
JD66  SJ_NO_THIN  [SJ_2S-NO-THIN]  10.67,46.1 90 top
JD67  SJ_NO_THIN  [SJ_2S-NO-THIN]  15.75,46.1 90 top
JD68  SJ_NO_THIN  [SJ_2S-NO-THIN]  20.83,46.1 90 top
JD69  SJ_NO_THIN  [SJ_2S-NO-THIN]  25.91,46.1 90 top
JD70  SJ_NO_THIN  [SJ_2S-NO-THIN]  30.99,46.1 90 top
JD71  SJ_NO_THIN  [SJ_2S-NO-THIN]  36.07,46.1 90 top
JD72  SJ_NO_THIN  [SJ_2S-NO-THIN]  41.15,46.1 90 top
JD73  SJ_NO_THIN  [SJ_2S-NO-THIN]  46.23,46.1 90 top
JD74  SJ_NO_THIN  [SJ_2S-NO-THIN]  51.31,46.1 90 top
JD75  SJ_NO_THIN  [SJ_2S-NO-THIN]  56.39,46.1 90 top
JD76  SJ_NO_THIN  [SJ_2S-NO-THIN]  61.47,46.1 90 top
JD77  SJ_NO_THIN  [SJ_2S-NO-THIN]  66.55,46.1 90 top
JD78  SJ_NO_THIN  [SJ_2S-NO-THIN]  71.63,46.1 90 top
JD79  SJ_NO_THIN  [SJ_2S-NO-THIN]  76.71,46.1 90 top
JD80  SJ_NO_THIN  [SJ_2S-NO-THIN]  81.79,46.1 90 top
JD81  SJ_NO_THIN  [SJ_2S-NO-THIN]  5.59,58.8 90 top
JD82  SJ_NO_THIN  [SJ_2S-NO-THIN]  10.67,58.8 90 top
JD83  SJ_NO_THIN  [SJ_2S-NO-THIN]  15.75,58.8 90 top
JD84  SJ_NO_THIN  [SJ_2S-NO-THIN]  20.83,58.8 90 top
JD85  SJ_NO_THIN  [SJ_2S-NO-THIN]  25.91,58.8 90 top
JD86  SJ_NO_THIN  [SJ_2S-NO-THIN]  30.99,58.8 90 top
JD87  SJ_NO_THIN  [SJ_2S-NO-THIN]  36.07,58.8 90 top
JD88  SJ_NO_THIN  [SJ_2S-NO-THIN]  41.15,58.8 90 top
JD89  SJ_NO_THIN  [SJ_2S-NO-THIN]  46.23,58.8 90 top
JD90  SJ_NO_THIN  [SJ_2S-NO-THIN]  51.31,58.8 90 top
JD91  SJ_NO_THIN  [SJ_2S-NO-THIN]  56.39,58.8 90 top
JD92  SJ_NO_THIN  [SJ_2S-NO-THIN]  61.47,58.8 90 top
JD93  SJ_NO_THIN  [SJ_2S-NO-THIN]  66.55,58.8 90 top
JD94  SJ_NO_THIN  [SJ_2S-NO-THIN]  71.63,58.8 90 top
JD95  SJ_NO_THIN  [SJ_2S-NO-THIN]  76.71,58.8 90 top
JD96  SJ_NO_THIN  [SJ_2S-NO-THIN]  81.79,58.8 90 top
JD97  SJ_NO_THIN  [SJ_2S-NO-THIN]  5.59,71.5 90 top
JD98  SJ_NO_THIN  [SJ_2S-NO-THIN]  10.67,71.5 90 top
JD99  SJ_NO_THIN  [SJ_2S-NO-THIN]  15.75,71.5 90 top
JD100  SJ_NO_THIN  [SJ_2S-NO-THIN]  20.83,71.5 90 top
JD101  SJ_NO_THIN  [SJ_2S-NO-THIN]  25.91,71.5 90 top
JD102  SJ_NO_THIN  [SJ_2S-NO-THIN]  30.99,71.5 90 top
JD103  SJ_NO_THIN  [SJ_2S-NO-THIN]  36.07,71.5 90 top
JD104  SJ_NO_THIN  [SJ_2S-NO-THIN]  41.15,71.5 90 top
JD105  SJ_NO_THIN  [SJ_2S-NO-THIN]  46.23,71.5 90 top
JD106  SJ_NO_THIN  [SJ_2S-NO-THIN]  51.31,71.5 90 top
JD107  SJ_NO_THIN  [SJ_2S-NO-THIN]  56.39,71.5 90 top
JD108  SJ_NO_THIN  [SJ_2S-NO-THIN]  61.47,71.5 90 top
JD109  SJ_NO_THIN  [SJ_2S-NO-THIN]  66.55,71.5 90 top
JD110  SJ_NO_THIN  [SJ_2S-NO-THIN]  71.63,71.5 90 top
JD111  SJ_NO_THIN  [SJ_2S-NO-THIN]  76.71,71.5 90 top
JD112  SJ_NO_THIN  [SJ_2S-NO-THIN]  81.79,71.5 90 top
JN2  SJ_NO_THIN  [SJ_2S-NO-THIN]  3.81,17.65 90 top
JN3  SJ_NO_THIN  [SJ_2S-NO-THIN]  8.89,17.65 90 top
JN4  SJ_NO_THIN  [SJ_2S-NO-THIN]  13.97,17.65 90 top
JN5  SJ_NO_THIN  [SJ_2S-NO-THIN]  19.05,17.65 90 top
JN21  SJ_NO_THIN  [SJ_2S-NO-THIN]  24.13,17.65 90 top
JN22  SJ_NO_THIN  [SJ_2S-NO-THIN]  29.21,17.65 90 top
JN23  SJ_NO_THIN  [SJ_2S-NO-THIN]  34.29,17.65 90 top
JN24  SJ_NO_THIN  [SJ_2S-NO-THIN]  39.37,17.65 90 top
JN25  SJ_NO_THIN  [SJ_2S-NO-THIN]  44.45,17.65 90 top
JN26  SJ_NO_THIN  [SJ_2S-NO-THIN]  49.53,17.65 90 top
JN27  SJ_NO_THIN  [SJ_2S-NO-THIN]  54.61,17.65 90 top
JN28  SJ_NO_THIN  [SJ_2S-NO-THIN]  59.69,17.65 90 top
JN29  SJ_NO_THIN  [SJ_2S-NO-THIN]  64.77,17.65 90 top
JN30  SJ_NO_THIN  [SJ_2S-NO-THIN]  69.85,17.65 90 top
JN31  SJ_NO_THIN  [SJ_2S-NO-THIN]  74.93,17.65 90 top
JN32  SJ_NO_THIN  [SJ_2S-NO-THIN]  80.01,17.65 90 top
JN33  SJ_NO_THIN  [SJ_2S-NO-THIN]  3.81,4.95 90 top
JN34  SJ_NO_THIN  [SJ_2S-NO-THIN]  8.89,4.95 90 top
JN35  SJ_NO_THIN  [SJ_2S-NO-THIN]  13.97,4.95 90 top
JN36  SJ_NO_THIN  [SJ_2S-NO-THIN]  19.05,4.95 90 top
JN37  SJ_NO_THIN  [SJ_2S-NO-THIN]  24.13,4.95 90 top
JN38  SJ_NO_THIN  [SJ_2S-NO-THIN]  29.21,4.95 90 top
JN39  SJ_NO_THIN  [SJ_2S-NO-THIN]  34.29,4.95 90 top
JN40  SJ_NO_THIN  [SJ_2S-NO-THIN]  39.37,4.95 90 top
JN41  SJ_NO_THIN  [SJ_2S-NO-THIN]  44.45,4.95 90 top
JN42  SJ_NO_THIN  [SJ_2S-NO-THIN]  49.53,4.95 90 top
JN43  SJ_NO_THIN  [SJ_2S-NO-THIN]  54.61,4.95 90 top
JN44  SJ_NO_THIN  [SJ_2S-NO-THIN]  59.69,4.95 90 top
JN45  SJ_NO_THIN  [SJ_2S-NO-THIN]  64.77,4.95 90 top
JN46  SJ_NO_THIN  [SJ_2S-NO-THIN]  69.85,4.95 90 top
JN47  SJ_NO_THIN  [SJ_2S-NO-THIN]  74.93,4.95 90 top
JN48  SJ_NO_THIN  [SJ_2S-NO-THIN]  80.01,4.95 90 top
JN49  SJ_NO_THIN  [SJ_2S-NO-THIN]  3.81,30.35 90 top
JN50  SJ_NO_THIN  [SJ_2S-NO-THIN]  8.89,30.35 90 top
JN51  SJ_NO_THIN  [SJ_2S-NO-THIN]  13.97,30.35 90 top
JN52  SJ_NO_THIN  [SJ_2S-NO-THIN]  19.05,30.35 90 top
JN53  SJ_NO_THIN  [SJ_2S-NO-THIN]  24.13,30.35 90 top
JN54  SJ_NO_THIN  [SJ_2S-NO-THIN]  29.21,30.35 90 top
JN55  SJ_NO_THIN  [SJ_2S-NO-THIN]  34.29,30.35 90 top
JN56  SJ_NO_THIN  [SJ_2S-NO-THIN]  39.37,30.35 90 top
JN57  SJ_NO_THIN  [SJ_2S-NO-THIN]  44.45,30.35 90 top
JN58  SJ_NO_THIN  [SJ_2S-NO-THIN]  49.53,30.35 90 top
JN59  SJ_NO_THIN  [SJ_2S-NO-THIN]  54.61,30.35 90 top
JN60  SJ_NO_THIN  [SJ_2S-NO-THIN]  59.69,30.35 90 top
JN61  SJ_NO_THIN  [SJ_2S-NO-THIN]  64.77,30.35 90 top
JN62  SJ_NO_THIN  [SJ_2S-NO-THIN]  69.85,30.35 90 top
JN63  SJ_NO_THIN  [SJ_2S-NO-THIN]  74.93,30.35 90 top
JN64  SJ_NO_THIN  [SJ_2S-NO-THIN]  80.01,30.35 90 top
JN65  SJ_NO_THIN  [SJ_2S-NO-THIN]  3.81,43.05 90 top
JN66  SJ_NO_THIN  [SJ_2S-NO-THIN]  8.89,43.05 90 top
JN67  SJ_NO_THIN  [SJ_2S-NO-THIN]  13.97,43.05 90 top
JN68  SJ_NO_THIN  [SJ_2S-NO-THIN]  19.05,43.05 90 top
JN69  SJ_NO_THIN  [SJ_2S-NO-THIN]  24.13,43.05 90 top
JN70  SJ_NO_THIN  [SJ_2S-NO-THIN]  29.21,43.05 90 top
JN71  SJ_NO_THIN  [SJ_2S-NO-THIN]  34.29,43.05 90 top
JN72  SJ_NO_THIN  [SJ_2S-NO-THIN]  39.37,43.05 90 top
JN73  SJ_NO_THIN  [SJ_2S-NO-THIN]  44.45,43.05 90 top
JN74  SJ_NO_THIN  [SJ_2S-NO-THIN]  49.53,43.05 90 top
JN75  SJ_NO_THIN  [SJ_2S-NO-THIN]  54.61,43.05 90 top
JN76  SJ_NO_THIN  [SJ_2S-NO-THIN]  59.69,43.05 90 top
JN77  SJ_NO_THIN  [SJ_2S-NO-THIN]  64.77,43.05 90 top
JN78  SJ_NO_THIN  [SJ_2S-NO-THIN]  69.85,43.05 90 top
JN79  SJ_NO_THIN  [SJ_2S-NO-THIN]  74.93,43.05 90 top
JN80  SJ_NO_THIN  [SJ_2S-NO-THIN]  80.01,43.05 90 top
JN81  SJ_NO_THIN  [SJ_2S-NO-THIN]  3.81,55.75 90 top
JN82  SJ_NO_THIN  [SJ_2S-NO-THIN]  8.89,55.75 90 top
JN83  SJ_NO_THIN  [SJ_2S-NO-THIN]  13.97,55.75 90 top
JN84  SJ_NO_THIN  [SJ_2S-NO-THIN]  19.05,55.75 90 top
JN85  SJ_NO_THIN  [SJ_2S-NO-THIN]  24.13,55.75 90 top
JN86  SJ_NO_THIN  [SJ_2S-NO-THIN]  29.21,55.75 90 top
JN87  SJ_NO_THIN  [SJ_2S-NO-THIN]  34.29,55.75 90 top
JN88  SJ_NO_THIN  [SJ_2S-NO-THIN]  39.37,55.75 90 top
JN89  SJ_NO_THIN  [SJ_2S-NO-THIN]  44.45,55.75 90 top
JN90  SJ_NO_THIN  [SJ_2S-NO-THIN]  49.53,55.75 90 top
JN91  SJ_NO_THIN  [SJ_2S-NO-THIN]  54.61,55.75 90 top
JN92  SJ_NO_THIN  [SJ_2S-NO-THIN]  59.69,55.75 90 top
JN93  SJ_NO_THIN  [SJ_2S-NO-THIN]  64.77,55.75 90 top
JN94  SJ_NO_THIN  [SJ_2S-NO-THIN]  69.85,55.75 90 top
JN95  SJ_NO_THIN  [SJ_2S-NO-THIN]  74.93,55.75 90 top
JN96  SJ_NO_THIN  [SJ_2S-NO-THIN]  80.01,55.75 90 top
JN97  SJ_NO_THIN  [SJ_2S-NO-THIN]  3.81,68.45 90 top
JN98  SJ_NO_THIN  [SJ_2S-NO-THIN]  8.89,68.45 90 top
JN99  SJ_NO_THIN  [SJ_2S-NO-THIN]  13.97,68.45 90 top
JN100  SJ_NO_THIN  [SJ_2S-NO-THIN]  19.05,68.45 90 top
JN101  SJ_NO_THIN  [SJ_2S-NO-THIN]  24.13,68.45 90 top
JN102  SJ_NO_THIN  [SJ_2S-NO-THIN]  29.21,68.45 90 top
JN103  SJ_NO_THIN  [SJ_2S-NO-THIN]  34.29,68.45 90 top
JN104  SJ_NO_THIN  [SJ_2S-NO-THIN]  39.37,68.45 90 top
JN105  SJ_NO_THIN  [SJ_2S-NO-THIN]  44.45,68.45 90 top
JN106  SJ_NO_THIN  [SJ_2S-NO-THIN]  49.53,68.45 90 top
JN107  SJ_NO_THIN  [SJ_2S-NO-THIN]  54.61,68.45 90 top
JN108  SJ_NO_THIN  [SJ_2S-NO-THIN]  59.69,68.45 90 top
JN109  SJ_NO_THIN  [SJ_2S-NO-THIN]  64.77,68.45 90 top
JN110  SJ_NO_THIN  [SJ_2S-NO-THIN]  69.85,68.45 90 top
JN111  SJ_NO_THIN  [SJ_2S-NO-THIN]  74.93,68.45 90 top
JN112  SJ_NO_THIN  [SJ_2S-NO-THIN]  80.01,68.45 90 top
JP2  SJ_NO_THIN  [SJ_2S-NO-THIN]  1.91,22.48 90 top
JP3  SJ_NO_THIN  [SJ_2S-NO-THIN]  6.99,22.48 90 top
JP4  SJ_NO_THIN  [SJ_2S-NO-THIN]  12.06,22.48 90 top
JP5  SJ_NO_THIN  [SJ_2S-NO-THIN]  17.14,22.48 90 top
JP21  SJ_NO_THIN  [SJ_2S-NO-THIN]  22.23,22.48 90 top
JP22  SJ_NO_THIN  [SJ_2S-NO-THIN]  27.3,22.48 90 top
JP23  SJ_NO_THIN  [SJ_2S-NO-THIN]  32.38,22.48 90 top
JP24  SJ_NO_THIN  [SJ_2S-NO-THIN]  37.47,22.48 90 top
JP25  SJ_NO_THIN  [SJ_2S-NO-THIN]  42.55,22.48 90 top
JP26  SJ_NO_THIN  [SJ_2S-NO-THIN]  47.62,22.48 90 top
JP27  SJ_NO_THIN  [SJ_2S-NO-THIN]  52.7,22.48 90 top
JP28  SJ_NO_THIN  [SJ_2S-NO-THIN]  57.78,22.48 90 top
JP29  SJ_NO_THIN  [SJ_2S-NO-THIN]  62.87,22.48 90 top
JP30  SJ_NO_THIN  [SJ_2S-NO-THIN]  67.94,22.48 90 top
JP31  SJ_NO_THIN  [SJ_2S-NO-THIN]  73.03,22.48 90 top
JP32  SJ_NO_THIN  [SJ_2S-NO-THIN]  78.11,22.48 90 top
JP33  SJ_NO_THIN  [SJ_2S-NO-THIN]  1.91,9.78 90 top
JP34  SJ_NO_THIN  [SJ_2S-NO-THIN]  6.99,9.78 90 top
JP35  SJ_NO_THIN  [SJ_2S-NO-THIN]  12.06,9.78 90 top
JP36  SJ_NO_THIN  [SJ_2S-NO-THIN]  17.14,9.78 90 top
JP37  SJ_NO_THIN  [SJ_2S-NO-THIN]  22.23,9.78 90 top
JP38  SJ_NO_THIN  [SJ_2S-NO-THIN]  27.3,9.78 90 top
JP39  SJ_NO_THIN  [SJ_2S-NO-THIN]  32.38,9.78 90 top
JP40  SJ_NO_THIN  [SJ_2S-NO-THIN]  37.47,9.78 90 top
JP41  SJ_NO_THIN  [SJ_2S-NO-THIN]  42.55,9.78 90 top
JP42  SJ_NO_THIN  [SJ_2S-NO-THIN]  47.62,9.78 90 top
JP43  SJ_NO_THIN  [SJ_2S-NO-THIN]  52.7,9.78 90 top
JP44  SJ_NO_THIN  [SJ_2S-NO-THIN]  57.78,9.78 90 top
JP45  SJ_NO_THIN  [SJ_2S-NO-THIN]  62.87,9.78 90 top
JP46  SJ_NO_THIN  [SJ_2S-NO-THIN]  67.94,9.78 90 top
JP47  SJ_NO_THIN  [SJ_2S-NO-THIN]  73.03,9.78 90 top
JP48  SJ_NO_THIN  [SJ_2S-NO-THIN]  78.11,9.78 90 top
JP49  SJ_NO_THIN  [SJ_2S-NO-THIN]  1.91,35.18 90 top
JP50  SJ_NO_THIN  [SJ_2S-NO-THIN]  6.99,35.18 90 top
JP51  SJ_NO_THIN  [SJ_2S-NO-THIN]  12.06,35.18 90 top
JP52  SJ_NO_THIN  [SJ_2S-NO-THIN]  17.14,35.18 90 top
JP53  SJ_NO_THIN  [SJ_2S-NO-THIN]  22.23,35.18 90 top
JP54  SJ_NO_THIN  [SJ_2S-NO-THIN]  27.3,35.18 90 top
JP55  SJ_NO_THIN  [SJ_2S-NO-THIN]  32.38,35.18 90 top
JP56  SJ_NO_THIN  [SJ_2S-NO-THIN]  37.47,35.18 90 top
JP57  SJ_NO_THIN  [SJ_2S-NO-THIN]  42.55,35.18 90 top
JP58  SJ_NO_THIN  [SJ_2S-NO-THIN]  47.62,35.18 90 top
JP59  SJ_NO_THIN  [SJ_2S-NO-THIN]  52.7,35.18 90 top
JP60  SJ_NO_THIN  [SJ_2S-NO-THIN]  57.78,35.18 90 top
JP61  SJ_NO_THIN  [SJ_2S-NO-THIN]  62.87,35.18 90 top
JP62  SJ_NO_THIN  [SJ_2S-NO-THIN]  67.94,35.18 90 top
JP63  SJ_NO_THIN  [SJ_2S-NO-THIN]  73.03,35.18 90 top
JP64  SJ_NO_THIN  [SJ_2S-NO-THIN]  78.11,35.18 90 top
JP65  SJ_NO_THIN  [SJ_2S-NO-THIN]  1.91,47.88 90 top
JP66  SJ_NO_THIN  [SJ_2S-NO-THIN]  6.99,47.88 90 top
JP67  SJ_NO_THIN  [SJ_2S-NO-THIN]  12.06,47.88 90 top
JP68  SJ_NO_THIN  [SJ_2S-NO-THIN]  17.14,47.88 90 top
JP69  SJ_NO_THIN  [SJ_2S-NO-THIN]  22.23,47.88 90 top
JP70  SJ_NO_THIN  [SJ_2S-NO-THIN]  27.3,47.88 90 top
JP71  SJ_NO_THIN  [SJ_2S-NO-THIN]  32.38,47.88 90 top
JP72  SJ_NO_THIN  [SJ_2S-NO-THIN]  37.47,47.88 90 top
JP73  SJ_NO_THIN  [SJ_2S-NO-THIN]  42.55,47.88 90 top
JP74  SJ_NO_THIN  [SJ_2S-NO-THIN]  47.62,47.88 90 top
JP75  SJ_NO_THIN  [SJ_2S-NO-THIN]  52.7,47.88 90 top
JP76  SJ_NO_THIN  [SJ_2S-NO-THIN]  57.78,47.88 90 top
JP77  SJ_NO_THIN  [SJ_2S-NO-THIN]  62.87,47.88 90 top
JP78  SJ_NO_THIN  [SJ_2S-NO-THIN]  67.94,47.88 90 top
JP79  SJ_NO_THIN  [SJ_2S-NO-THIN]  73.03,47.88 90 top
JP80  SJ_NO_THIN  [SJ_2S-NO-THIN]  78.11,47.88 90 top
JP81  SJ_NO_THIN  [SJ_2S-NO-THIN]  1.91,60.58 90 top
JP82  SJ_NO_THIN  [SJ_2S-NO-THIN]  6.99,60.58 90 top
JP83  SJ_NO_THIN  [SJ_2S-NO-THIN]  12.06,60.58 90 top
JP84  SJ_NO_THIN  [SJ_2S-NO-THIN]  17.14,60.58 90 top
JP85  SJ_NO_THIN  [SJ_2S-NO-THIN]  22.23,60.58 90 top
JP86  SJ_NO_THIN  [SJ_2S-NO-THIN]  27.3,60.58 90 top
JP87  SJ_NO_THIN  [SJ_2S-NO-THIN]  32.38,60.58 90 top
JP88  SJ_NO_THIN  [SJ_2S-NO-THIN]  37.47,60.58 90 top
JP89  SJ_NO_THIN  [SJ_2S-NO-THIN]  42.55,60.58 90 top
JP90  SJ_NO_THIN  [SJ_2S-NO-THIN]  47.62,60.58 90 top
JP91  SJ_NO_THIN  [SJ_2S-NO-THIN]  52.7,60.58 90 top
JP92  SJ_NO_THIN  [SJ_2S-NO-THIN]  57.78,60.58 90 top
JP93  SJ_NO_THIN  [SJ_2S-NO-THIN]  62.87,60.58 90 top
JP94  SJ_NO_THIN  [SJ_2S-NO-THIN]  67.94,60.58 90 top
JP95  SJ_NO_THIN  [SJ_2S-NO-THIN]  73.03,60.58 90 top
JP96  SJ_NO_THIN  [SJ_2S-NO-THIN]  78.11,60.58 90 top
JP97  SJ_NO_THIN  [SJ_2S-NO-THIN]  1.91,73.28 90 top
JP98  SJ_NO_THIN  [SJ_2S-NO-THIN]  6.99,73.28 90 top
JP99  SJ_NO_THIN  [SJ_2S-NO-THIN]  12.06,73.28 90 top
JP100  SJ_NO_THIN  [SJ_2S-NO-THIN]  17.14,73.28 90 top
JP101  SJ_NO_THIN  [SJ_2S-NO-THIN]  22.23,73.28 90 top
JP102  SJ_NO_THIN  [SJ_2S-NO-THIN]  27.3,73.28 90 top
JP103  SJ_NO_THIN  [SJ_2S-NO-THIN]  32.38,73.28 90 top
JP104  SJ_NO_THIN  [SJ_2S-NO-THIN]  37.47,73.28 90 top
JP105  SJ_NO_THIN  [SJ_2S-NO-THIN]  42.55,73.28 90 top
JP106  SJ_NO_THIN  [SJ_2S-NO-THIN]  47.62,73.28 90 top
JP107  SJ_NO_THIN  [SJ_2S-NO-THIN]  52.7,73.28 90 top
JP108  SJ_NO_THIN  [SJ_2S-NO-THIN]  57.78,73.28 90 top
JP109  SJ_NO_THIN  [SJ_2S-NO-THIN]  62.87,73.28 90 top
JP110  SJ_NO_THIN  [SJ_2S-NO-THIN]  67.94,73.28 90 top
JP111  SJ_NO_THIN  [SJ_2S-NO-THIN]  73.03,73.28 90 top
JP112  SJ_NO_THIN  [SJ_2S-NO-THIN]  78.11,73.28 90 top
JS2  SJ_NO_THIN  [SJ_2S-NO-THIN]  3.81,14.86 90 top
JS3  SJ_NO_THIN  [SJ_2S-NO-THIN]  8.89,14.86 90 top
JS4  SJ_NO_THIN  [SJ_2S-NO-THIN]  13.97,14.86 90 top
JS5  SJ_NO_THIN  [SJ_2S-NO-THIN]  19.05,14.86 90 top
JS21  SJ_NO_THIN  [SJ_2S-NO-THIN]  24.13,14.86 90 top
JS22  SJ_NO_THIN  [SJ_2S-NO-THIN]  29.21,14.86 90 top
JS23  SJ_NO_THIN  [SJ_2S-NO-THIN]  34.29,14.86 90 top
JS24  SJ_NO_THIN  [SJ_2S-NO-THIN]  39.37,14.86 90 top
JS25  SJ_NO_THIN  [SJ_2S-NO-THIN]  44.45,14.86 90 top
JS26  SJ_NO_THIN  [SJ_2S-NO-THIN]  49.53,14.86 90 top
JS27  SJ_NO_THIN  [SJ_2S-NO-THIN]  54.61,14.86 90 top
JS28  SJ_NO_THIN  [SJ_2S-NO-THIN]  59.69,14.86 90 top
JS29  SJ_NO_THIN  [SJ_2S-NO-THIN]  64.77,14.86 90 top
JS30  SJ_NO_THIN  [SJ_2S-NO-THIN]  69.85,14.86 90 top
JS31  SJ_NO_THIN  [SJ_2S-NO-THIN]  74.93,14.86 90 top
JS32  SJ_NO_THIN  [SJ_2S-NO-THIN]  80.01,14.86 90 top
JS33  SJ_NO_THIN  [SJ_2S-NO-THIN]  3.81,2.16 90 top
JS34  SJ_NO_THIN  [SJ_2S-NO-THIN]  8.89,2.16 90 top
JS35  SJ_NO_THIN  [SJ_2S-NO-THIN]  13.97,2.16 90 top
JS36  SJ_NO_THIN  [SJ_2S-NO-THIN]  19.05,2.16 90 top
JS37  SJ_NO_THIN  [SJ_2S-NO-THIN]  24.13,2.16 90 top
JS38  SJ_NO_THIN  [SJ_2S-NO-THIN]  29.21,2.16 90 top
JS39  SJ_NO_THIN  [SJ_2S-NO-THIN]  34.29,2.16 90 top
JS40  SJ_NO_THIN  [SJ_2S-NO-THIN]  39.37,2.16 90 top
JS41  SJ_NO_THIN  [SJ_2S-NO-THIN]  44.45,2.16 90 top
JS42  SJ_NO_THIN  [SJ_2S-NO-THIN]  49.53,2.16 90 top
JS43  SJ_NO_THIN  [SJ_2S-NO-THIN]  54.61,2.16 90 top
JS44  SJ_NO_THIN  [SJ_2S-NO-THIN]  59.69,2.16 90 top
JS45  SJ_NO_THIN  [SJ_2S-NO-THIN]  64.77,2.16 90 top
JS46  SJ_NO_THIN  [SJ_2S-NO-THIN]  69.85,2.16 90 top
JS47  SJ_NO_THIN  [SJ_2S-NO-THIN]  74.93,2.16 90 top
JS48  SJ_NO_THIN  [SJ_2S-NO-THIN]  80.01,2.16 90 top
JS49  SJ_NO_THIN  [SJ_2S-NO-THIN]  3.81,27.56 90 top
JS50  SJ_NO_THIN  [SJ_2S-NO-THIN]  8.89,27.56 90 top
JS51  SJ_NO_THIN  [SJ_2S-NO-THIN]  13.97,27.56 90 top
JS52  SJ_NO_THIN  [SJ_2S-NO-THIN]  19.05,27.56 90 top
JS53  SJ_NO_THIN  [SJ_2S-NO-THIN]  24.13,27.56 90 top
JS54  SJ_NO_THIN  [SJ_2S-NO-THIN]  29.21,27.56 90 top
JS55  SJ_NO_THIN  [SJ_2S-NO-THIN]  34.29,27.56 90 top
JS56  SJ_NO_THIN  [SJ_2S-NO-THIN]  39.37,27.56 90 top
JS57  SJ_NO_THIN  [SJ_2S-NO-THIN]  44.45,27.56 90 top
JS58  SJ_NO_THIN  [SJ_2S-NO-THIN]  49.53,27.56 90 top
JS59  SJ_NO_THIN  [SJ_2S-NO-THIN]  54.61,27.56 90 top
JS60  SJ_NO_THIN  [SJ_2S-NO-THIN]  59.69,27.56 90 top
JS61  SJ_NO_THIN  [SJ_2S-NO-THIN]  64.77,27.56 90 top
JS62  SJ_NO_THIN  [SJ_2S-NO-THIN]  69.85,27.56 90 top
JS63  SJ_NO_THIN  [SJ_2S-NO-THIN]  74.93,27.56 90 top
JS64  SJ_NO_THIN  [SJ_2S-NO-THIN]  80.01,27.56 90 top
JS65  SJ_NO_THIN  [SJ_2S-NO-THIN]  3.81,40.26 90 top
JS66  SJ_NO_THIN  [SJ_2S-NO-THIN]  8.89,40.26 90 top
JS67  SJ_NO_THIN  [SJ_2S-NO-THIN]  13.97,40.26 90 top
JS68  SJ_NO_THIN  [SJ_2S-NO-THIN]  19.05,40.26 90 top
JS69  SJ_NO_THIN  [SJ_2S-NO-THIN]  24.13,40.26 90 top
JS70  SJ_NO_THIN  [SJ_2S-NO-THIN]  29.21,40.26 90 top
JS71  SJ_NO_THIN  [SJ_2S-NO-THIN]  34.29,40.26 90 top
JS72  SJ_NO_THIN  [SJ_2S-NO-THIN]  39.37,40.26 90 top
JS73  SJ_NO_THIN  [SJ_2S-NO-THIN]  44.45,40.26 90 top
JS74  SJ_NO_THIN  [SJ_2S-NO-THIN]  49.53,40.26 90 top
JS75  SJ_NO_THIN  [SJ_2S-NO-THIN]  54.61,40.26 90 top
JS76  SJ_NO_THIN  [SJ_2S-NO-THIN]  59.69,40.26 90 top
JS77  SJ_NO_THIN  [SJ_2S-NO-THIN]  64.77,40.26 90 top
JS78  SJ_NO_THIN  [SJ_2S-NO-THIN]  69.85,40.26 90 top
JS79  SJ_NO_THIN  [SJ_2S-NO-THIN]  74.93,40.26 90 top
JS80  SJ_NO_THIN  [SJ_2S-NO-THIN]  80.01,40.26 90 top
JS81  SJ_NO_THIN  [SJ_2S-NO-THIN]  3.81,52.96 90 top
JS82  SJ_NO_THIN  [SJ_2S-NO-THIN]  8.89,52.96 90 top
JS83  SJ_NO_THIN  [SJ_2S-NO-THIN]  13.97,52.96 90 top
JS84  SJ_NO_THIN  [SJ_2S-NO-THIN]  19.05,52.96 90 top
JS85  SJ_NO_THIN  [SJ_2S-NO-THIN]  24.13,52.96 90 top
JS86  SJ_NO_THIN  [SJ_2S-NO-THIN]  29.21,52.96 90 top
JS87  SJ_NO_THIN  [SJ_2S-NO-THIN]  34.29,52.96 90 top
JS88  SJ_NO_THIN  [SJ_2S-NO-THIN]  39.37,52.96 90 top
JS89  SJ_NO_THIN  [SJ_2S-NO-THIN]  44.45,52.96 90 top
JS90  SJ_NO_THIN  [SJ_2S-NO-THIN]  49.53,52.96 90 top
JS91  SJ_NO_THIN  [SJ_2S-NO-THIN]  54.61,52.96 90 top
JS92  SJ_NO_THIN  [SJ_2S-NO-THIN]  59.69,52.96 90 top
JS93  SJ_NO_THIN  [SJ_2S-NO-THIN]  64.77,52.96 90 top
JS94  SJ_NO_THIN  [SJ_2S-NO-THIN]  69.85,52.96 90 top
JS95  SJ_NO_THIN  [SJ_2S-NO-THIN]  74.93,52.96 90 top
JS96  SJ_NO_THIN  [SJ_2S-NO-THIN]  80.01,52.96 90 top
JS97  SJ_NO_THIN  [SJ_2S-NO-THIN]  3.81,65.66 90 top
JS98  SJ_NO_THIN  [SJ_2S-NO-THIN]  8.89,65.66 90 top
JS99  SJ_NO_THIN  [SJ_2S-NO-THIN]  13.97,65.66 90 top
JS100  SJ_NO_THIN  [SJ_2S-NO-THIN]  19.05,65.66 90 top
JS101  SJ_NO_THIN  [SJ_2S-NO-THIN]  24.13,65.66 90 top
JS102  SJ_NO_THIN  [SJ_2S-NO-THIN]  29.21,65.66 90 top
JS103  SJ_NO_THIN  [SJ_2S-NO-THIN]  34.29,65.66 90 top
JS104  SJ_NO_THIN  [SJ_2S-NO-THIN]  39.37,65.66 90 top
JS105  SJ_NO_THIN  [SJ_2S-NO-THIN]  44.45,65.66 90 top
JS106  SJ_NO_THIN  [SJ_2S-NO-THIN]  49.53,65.66 90 top
JS107  SJ_NO_THIN  [SJ_2S-NO-THIN]  54.61,65.66 90 top
JS108  SJ_NO_THIN  [SJ_2S-NO-THIN]  59.69,65.66 90 top
JS109  SJ_NO_THIN  [SJ_2S-NO-THIN]  64.77,65.66 90 top
JS110  SJ_NO_THIN  [SJ_2S-NO-THIN]  69.85,65.66 90 top
JS111  SJ_NO_THIN  [SJ_2S-NO-THIN]  74.93,65.66 90 top
JS112  SJ_NO_THIN  [SJ_2S-NO-THIN]  80.01,65.66 90 top
LED2  TPTHT  [PROTOPAD-THT-PAD]  2.67,78.36 0 top
LED3  TPTHT  [PROTOPAD-THT-PAD]  16.89,78.36 0 top
LED4  TPTHT  [PROTOPAD-THT-PAD]  6.22,78.36 0 top
LED5  TPTHT  [PROTOPAD-THT-PAD]  24,78.36 0 top
LED6  TPTHT  [PROTOPAD-THT-PAD]  9.78,78.36 0 top
LED7  TPTHT  [PROTOPAD-THT-PAD]  20.45,78.36 0 top
LED8  TPTHT  [PROTOPAD-THT-PAD]  13.34,78.36 0 top
LED9  TPTHT  [PROTOPAD-THT-PAD]  27.56,78.36 0 top
LED10  TPTHT  [PROTOPAD-THT-PAD]  31.11,78.36 0 top
LED11  TPTHT  [PROTOPAD-THT-PAD]  34.67,78.36 0 top
LED12  TPTHT  [PROTOPAD-THT-PAD]  38.23,78.36 0 top
LED13  TPTHT  [PROTOPAD-THT-PAD]  41.78,78.36 0 top
LED14  TPTHT  [PROTOPAD-THT-PAD]  45.34,78.36 0 top
LED15  TPTHT  [PROTOPAD-THT-PAD]  48.9,78.36 0 top
LED16  TPTHT  [PROTOPAD-THT-PAD]  52.45,78.36 0 top
LED17  TPTHT  [PROTOPAD-THT-PAD]  56.01,78.36 0 top
LED18  TPTHT  [PROTOPAD-THT-PAD]  59.56,78.36 0 top
LED19  TPTHT  [PROTOPAD-THT-PAD]  63.12,78.36 0 top
LED20  TPTHT  [PROTOPAD-THT-PAD]  66.67,78.36 0 top
LED21  TPTHT  [PROTOPAD-THT-PAD]  70.23,78.36 0 top
LED22  TPTHT  [PROTOPAD-THT-PAD]  73.79,78.36 0 top
LED23  TPTHT  [PROTOPAD-THT-PAD]  77.34,78.36 0 top
LED24  TPTHT  [PROTOPAD-THT-PAD]  80.9,78.36 0 top
Q2  2N7002  [SOT23]  2.67,81.41 0 top
Q3  2N7002  [SOT23]  16.89,81.41 0 top
Q4  2N7002  [SOT23]  6.22,81.41 0 top
Q5  2N7002  [SOT23]  24,81.41 0 top
Q6  2N7002  [SOT23]  9.78,81.41 0 top
Q7  2N7002  [SOT23]  20.45,81.41 0 top
Q8  2N7002  [SOT23]  13.34,81.41 0 top
Q9  2N7002  [SOT23]  27.56,81.41 0 top
Q10  2N7002  [SOT23]  31.11,81.41 0 top
Q11  2N7002  [SOT23]  34.67,81.41 0 top
Q12  2N7002  [SOT23]  38.23,81.41 0 top
Q13  2N7002  [SOT23]  41.78,81.41 0 top
Q14  2N7002  [SOT23]  45.34,81.41 0 top
Q15  2N7002  [SOT23]  48.9,81.41 0 top
Q16  2N7002  [SOT23]  52.45,81.41 0 top
Q17  2N7002  [SOT23]  56.01,81.41 0 top
Q18  2N7002  [SOT23]  59.56,81.41 0 top
Q19  2N7002  [SOT23]  63.12,81.41 0 top
Q20  2N7002  [SOT23]  66.67,81.41 0 top
Q21  2N7002  [SOT23]  70.23,81.41 0 top
Q22  2N7002  [SOT23]  73.79,81.41 0 top
Q23  2N7002  [SOT23]  77.34,81.41 0 top
Q24  2N7002  [SOT23]  80.9,81.41 0 top
Q25  2N7002  [SOT23]  3.17,20.57 0 top
Q26  2N7002  [SOT23]  8.26,20.57 0 top
Q27  2N7002  [SOT23]  13.34,20.57 0 top
Q28  2N7002  [SOT23]  18.41,20.57 0 top
Q29  2N7002  [SOT23]  23.5,20.57 0 top
Q30  2N7002  [SOT23]  28.57,20.57 0 top
Q31  2N7002  [SOT23]  33.66,20.57 0 top
Q32  2N7002  [SOT23]  38.73,20.57 0 top
Q33  2N7002  [SOT23]  43.81,20.57 0 top
Q34  2N7002  [SOT23]  48.9,20.57 0 top
Q35  2N7002  [SOT23]  53.98,20.57 0 top
Q36  2N7002  [SOT23]  59.05,20.57 0 top
Q37  2N7002  [SOT23]  64.14,20.57 0 top
Q38  2N7002  [SOT23]  69.22,20.57 0 top
Q39  2N7002  [SOT23]  74.3,20.57 0 top
Q40  2N7002  [SOT23]  79.38,20.57 0 top
Q41  2N7002  [SOT23]  3.17,7.87 0 top
Q42  2N7002  [SOT23]  8.26,7.87 0 top
Q43  2N7002  [SOT23]  13.34,7.87 0 top
Q44  2N7002  [SOT23]  18.41,7.87 0 top
Q45  2N7002  [SOT23]  23.5,7.87 0 top
Q46  2N7002  [SOT23]  28.57,7.87 0 top
Q47  2N7002  [SOT23]  33.66,7.87 0 top
Q48  2N7002  [SOT23]  38.73,7.87 0 top
Q49  2N7002  [SOT23]  43.81,7.87 0 top
Q50  2N7002  [SOT23]  48.9,7.87 0 top
Q51  2N7002  [SOT23]  53.98,7.87 0 top
Q52  2N7002  [SOT23]  59.05,7.87 0 top
Q53  2N7002  [SOT23]  64.14,7.87 0 top
Q54  2N7002  [SOT23]  69.22,7.87 0 top
Q55  2N7002  [SOT23]  74.3,7.87 0 top
Q56  2N7002  [SOT23]  79.38,7.87 0 top
Q57  2N7002  [SOT23]  3.17,33.27 0 top
Q58  2N7002  [SOT23]  8.26,33.27 0 top
Q59  2N7002  [SOT23]  13.34,33.27 0 top
Q60  2N7002  [SOT23]  18.41,33.27 0 top
Q61  2N7002  [SOT23]  23.5,33.27 0 top
Q62  2N7002  [SOT23]  28.57,33.27 0 top
Q63  2N7002  [SOT23]  33.66,33.27 0 top
Q64  2N7002  [SOT23]  38.73,33.27 0 top
Q65  2N7002  [SOT23]  43.81,33.27 0 top
Q66  2N7002  [SOT23]  48.9,33.27 0 top
Q67  2N7002  [SOT23]  53.98,33.27 0 top
Q68  2N7002  [SOT23]  59.05,33.27 0 top
Q69  2N7002  [SOT23]  64.14,33.27 0 top
Q70  2N7002  [SOT23]  69.22,33.27 0 top
Q71  2N7002  [SOT23]  74.3,33.27 0 top
Q72  2N7002  [SOT23]  79.38,33.27 0 top
Q73  2N7002  [SOT23]  3.17,45.97 0 top
Q74  2N7002  [SOT23]  8.26,45.97 0 top
Q75  2N7002  [SOT23]  13.34,45.97 0 top
Q76  2N7002  [SOT23]  18.41,45.97 0 top
Q77  2N7002  [SOT23]  23.5,45.97 0 top
Q78  2N7002  [SOT23]  28.57,45.97 0 top
Q79  2N7002  [SOT23]  33.66,45.97 0 top
Q80  2N7002  [SOT23]  38.73,45.97 0 top
Q81  2N7002  [SOT23]  43.81,45.97 0 top
Q82  2N7002  [SOT23]  48.9,45.97 0 top
Q83  2N7002  [SOT23]  53.98,45.97 0 top
Q84  2N7002  [SOT23]  59.05,45.97 0 top
Q85  2N7002  [SOT23]  64.14,45.97 0 top
Q86  2N7002  [SOT23]  69.22,45.97 0 top
Q87  2N7002  [SOT23]  74.3,45.97 0 top
Q88  2N7002  [SOT23]  79.38,45.97 0 top
Q89  2N7002  [SOT23]  3.17,58.67 0 top
Q90  2N7002  [SOT23]  8.26,58.67 0 top
Q91  2N7002  [SOT23]  13.34,58.67 0 top
Q92  2N7002  [SOT23]  18.41,58.67 0 top
Q93  2N7002  [SOT23]  23.5,58.67 0 top
Q94  2N7002  [SOT23]  28.57,58.67 0 top
Q95  2N7002  [SOT23]  33.66,58.67 0 top
Q96  2N7002  [SOT23]  38.73,58.67 0 top
Q97  2N7002  [SOT23]  43.81,58.67 0 top
Q98  2N7002  [SOT23]  48.9,58.67 0 top
Q99  2N7002  [SOT23]  53.98,58.67 0 top
Q100  2N7002  [SOT23]  59.05,58.67 0 top
Q101  2N7002  [SOT23]  64.14,58.67 0 top
Q102  2N7002  [SOT23]  69.22,58.67 0 top
Q103  2N7002  [SOT23]  74.3,58.67 0 top
Q104  2N7002  [SOT23]  79.38,58.67 0 top
Q105  2N7002  [SOT23]  3.17,71.37 0 top
Q106  2N7002  [SOT23]  8.26,71.37 0 top
Q107  2N7002  [SOT23]  13.34,71.37 0 top
Q108  2N7002  [SOT23]  18.41,71.37 0 top
Q109  2N7002  [SOT23]  23.5,71.37 0 top
Q110  2N7002  [SOT23]  28.57,71.37 0 top
Q111  2N7002  [SOT23]  33.66,71.37 0 top
Q112  2N7002  [SOT23]  38.73,71.37 0 top
Q113  2N7002  [SOT23]  43.81,71.37 0 top
Q114  2N7002  [SOT23]  48.9,71.37 0 top
Q115  2N7002  [SOT23]  53.98,71.37 0 top
Q116  2N7002  [SOT23]  59.05,71.37 0 top
Q117  2N7002  [SOT23]  64.14,71.37 0 top
Q118  2N7002  [SOT23]  69.22,71.37 0 top
Q119  2N7002  [SOT23]  74.3,71.37 0 top
Q120  2N7002  [SOT23]  79.38,71.37 0 top
R2  330  [R0603]  2.67,84.45 0 top
R3  330  [R0603]  16.89,84.45 0 top
R4  330  [R0603]  6.22,84.45 0 top
R5  330  [R0603]  24,84.45 0 top
R6  330  [R0603]  9.78,84.45 0 top
R7  330  [R0603]  20.45,84.45 0 top
R8  330  [R0603]  13.34,84.45 0 top
R9  330  [R0603]  27.56,84.45 0 top
R10  330  [R0603]  31.11,84.45 0 top
R11  330  [R0603]  34.67,84.45 0 top